# EAGLE design 10AmpBuckV3 (EAGLE 6.4)
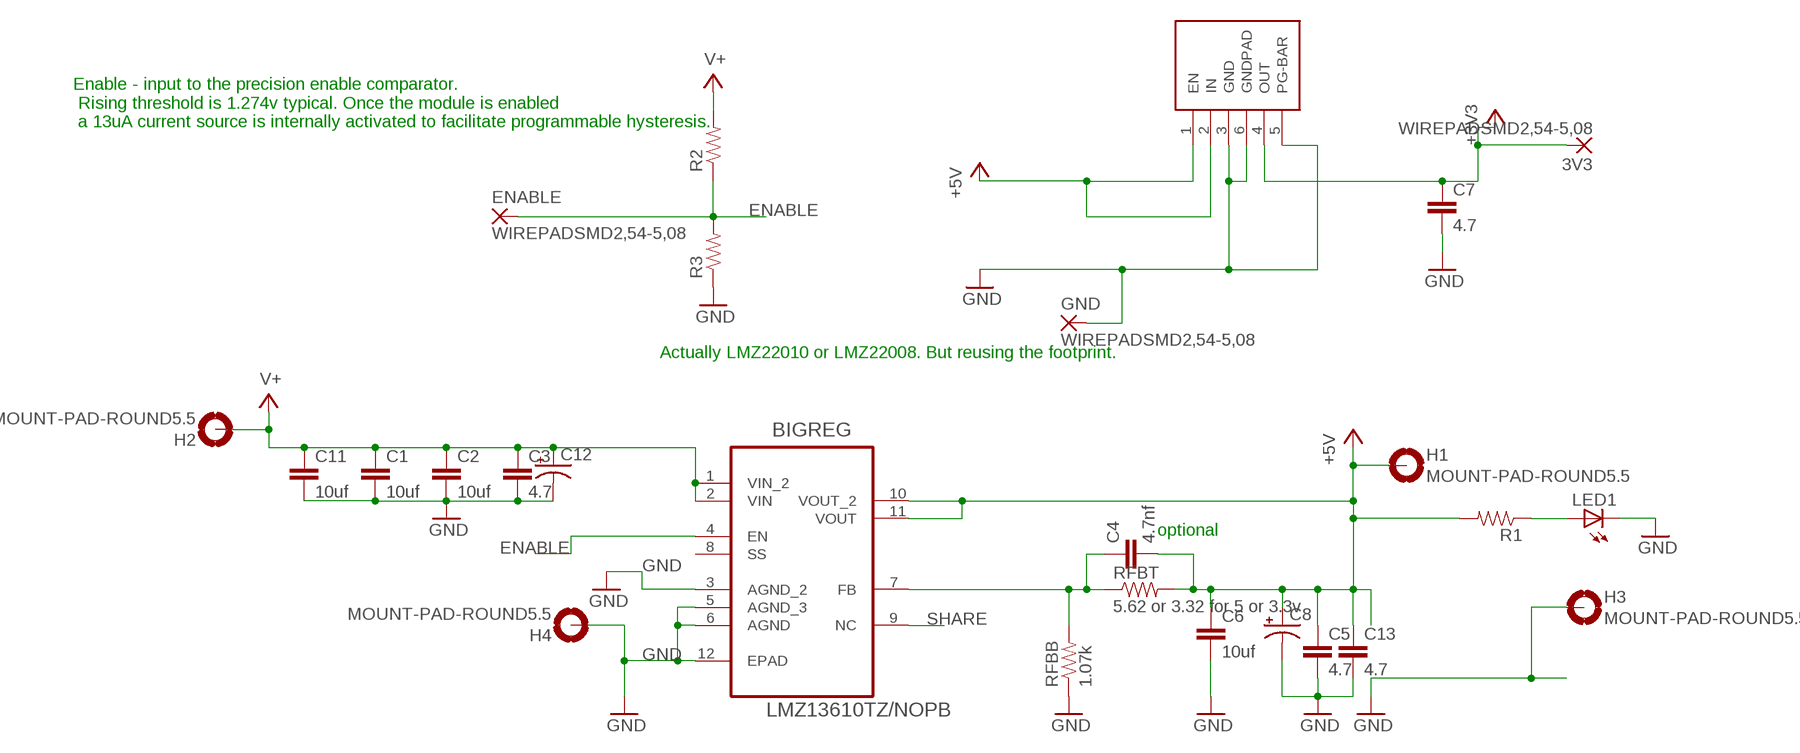
[diagram p0: schematic, sheet 1]

## Parts
3V3  WIREPADSMD2,54-5,08  [SMD2,54-5,08]
BIGREG  LMZ13610TZ/NOPB  [TI_TO-PMOD-11]
C1  10uf  CAP1206  [1206]
C2  10uf  CAP1206  [1206]
C3  4.7  CAP1206  [1206]
C4  4.7nf  CAP0603-CAP  [0603-CAP]
C5  4.7  CAP1206  [1206]
C6  10uf  CAP1206  [1206]
C7  4.7  CAP1206  [1206]
C8  CAP_POLPTH1  [CPOL-RADIAL-100UF-25V]
C11  10uf  CAP1206  [1206]
C12  CAP_POLPTH1  [CPOL-RADIAL-100UF-25V]
C13  4.7  CAP1206  [1206]
ENABLE  WIREPADSMD2,54-5,08  [SMD2,54-5,08]
GND  WIREPADSMD2,54-5,08  [SMD2,54-5,08]
H1  MOUNT-PAD-ROUND5.5  [5,5-PAD]
H2  MOUNT-PAD-ROUND5.5  [5,5-PAD]
H3  MOUNT-PAD-ROUND5.5  [5,5-PAD]
H4  MOUNT-PAD-ROUND5.5  [5,5-PAD]
LED1  LED1206  [LED-1206]
R1  RESISTOR0603-RES  [0603-RES]
R2  RESISTOR0603-RES  [0603-RES]
R3  RESISTOR0603-RES  [0603-RES]
RFBB  1.07k  RESISTOR0603  [0603-RES]
RFBT  5.62 or 3.32 for 5 or 3.3v  RESISTOR0603  [0603-RES]
U$1  TPS75533  [TO263-5]

## Nets
+3V3: 3V3.1(P) C7.1 U$1.4(OUT)
+5V: BIGREG.10(VOUT_2) BIGREG.11(VOUT) C4.2 C5.1 C6.1 C8.1(+) C13.1 H1.B5,5(MOUNT) R1.2 RFBT.2 U$1.1(EN) U$1.2(IN)
ENABLE: BIGREG.4(EN) ENABLE.1(P) R2.1 R3.2
GND: BIGREG.3(AGND_2) BIGREG.5(AGND_3) BIGREG.6(AGND) BIGREG.12(EPAD) C1.2 C2.2 C3.2 C5.2 C6.2 C7.2 C8.2(-) C11.2 C12.2(-) C13.2 GND.1(P) H3.B5,5(MOUNT) H4.B5,5(MOUNT) LED1.C R3.1 RFBB.1 U$1.3(GND) U$1.5(PG-BAR) U$1.6(GNDPAD)
N$2: BIGREG.7(FB) C4.1 RFBB.2 RFBT.1
N$3: LED1.A R1.1
SHARE: BIGREG.9(NC)
V+: BIGREG.1(VIN_2) BIGREG.2(VIN) C1.1 C2.1 C3.1 C11.1 C12.1(+) H2.B5,5(MOUNT) R2.2
Unconnected: BIGREG.8(SS)

## Notes on the sheet
- Enable - input to the precision enable comparator.
   Rising threshold is 1.274v typical. Once the module is enabled
   a 13uA current source is internally activated to facilitate programmable hysteresis.
- Actually LMZ22010 or LMZ22008. But reusing the footprint.
- optional

## Library data of the parts
3V3 ENABLE GND = wirepad:WIREPAD: Wire PAD connect wire on PCB
BIGREG = TI-Eagle_library:LMZ13610TZ/NOPB: BUCK, SYNC, ADJ, 10A, TO-PMOD-11; MPN: LMZ13610TZ/NOPB; OC_FARNELL: 1922943; OC_NEWARK: 47T7393; PACKAGE: TO-PMOD-11; SUPPLIER: TEXAS INSTRUMENTS
C1-C3 C5-C7 C11 C13 = SparkFun-Capacitors:CAP: Capacitor Standard 0603 ceramic capacitor, and 0.1" leaded capacitor.
C4 = SparkFun-Passives:CAP: Capacitor Standard 0603 ceramic capacitor, and 0.1" leaded capacitor.
C8 C12 = SparkFun-Capacitors:CAP_POL: Capacitor Polarized These are standard SMD and PTH capacitors. Normally 10uF, 47uF, and 100uF in electrolytic and tantalum varieties. Always verify the external diameter of the through hole cap, it varies with capacity, voltage, and manufacturer. The EIA devices should be standard.
H1-H4 = holes:MOUNT-PAD-ROUND: MOUNTING PAD, round
LED1 = LilyPad-Wearables:LED: LEDs Standard schematic elements and footprints for 5mm, 3mm, 1206, and 0603 sized LEDs. 5mm - Spark Fun Electronics SKU : Comp-SBL
R1-R3 = SparkFun-Passives:RESISTOR: Resistor Basic schematic elements and footprints for 0603, 1206, and PTH resistors.
RFBB RFBT = SparkFun-Resistors:RESISTOR: Resistor Basic schematic elements and footprints for 0603, 1206, and PTH resistors.
U$1 = James:TPS75533

## Net classes
0 default: width 0.762 mm

## Board
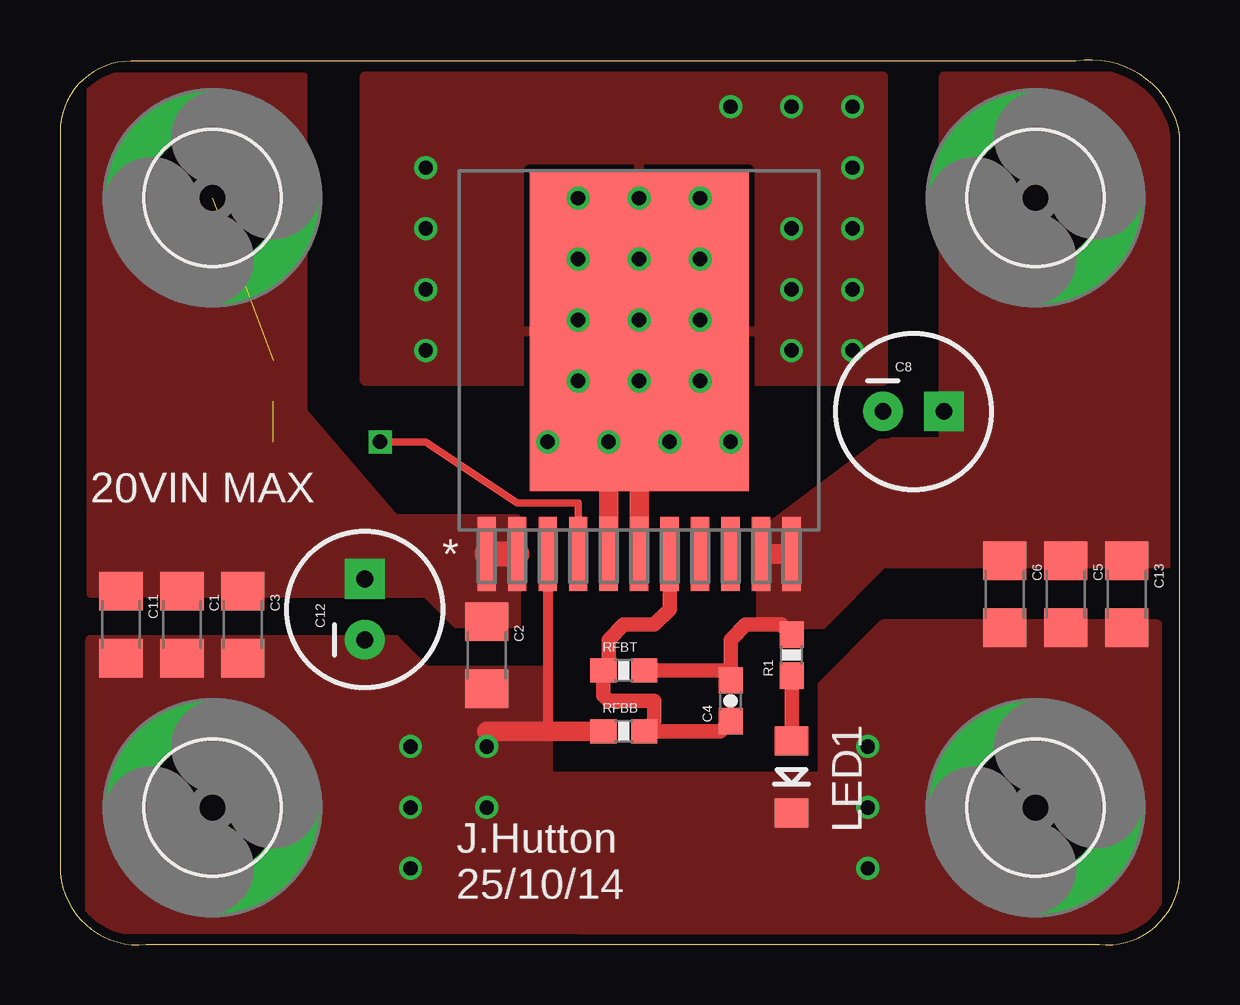
[diagram p1: board, top side]
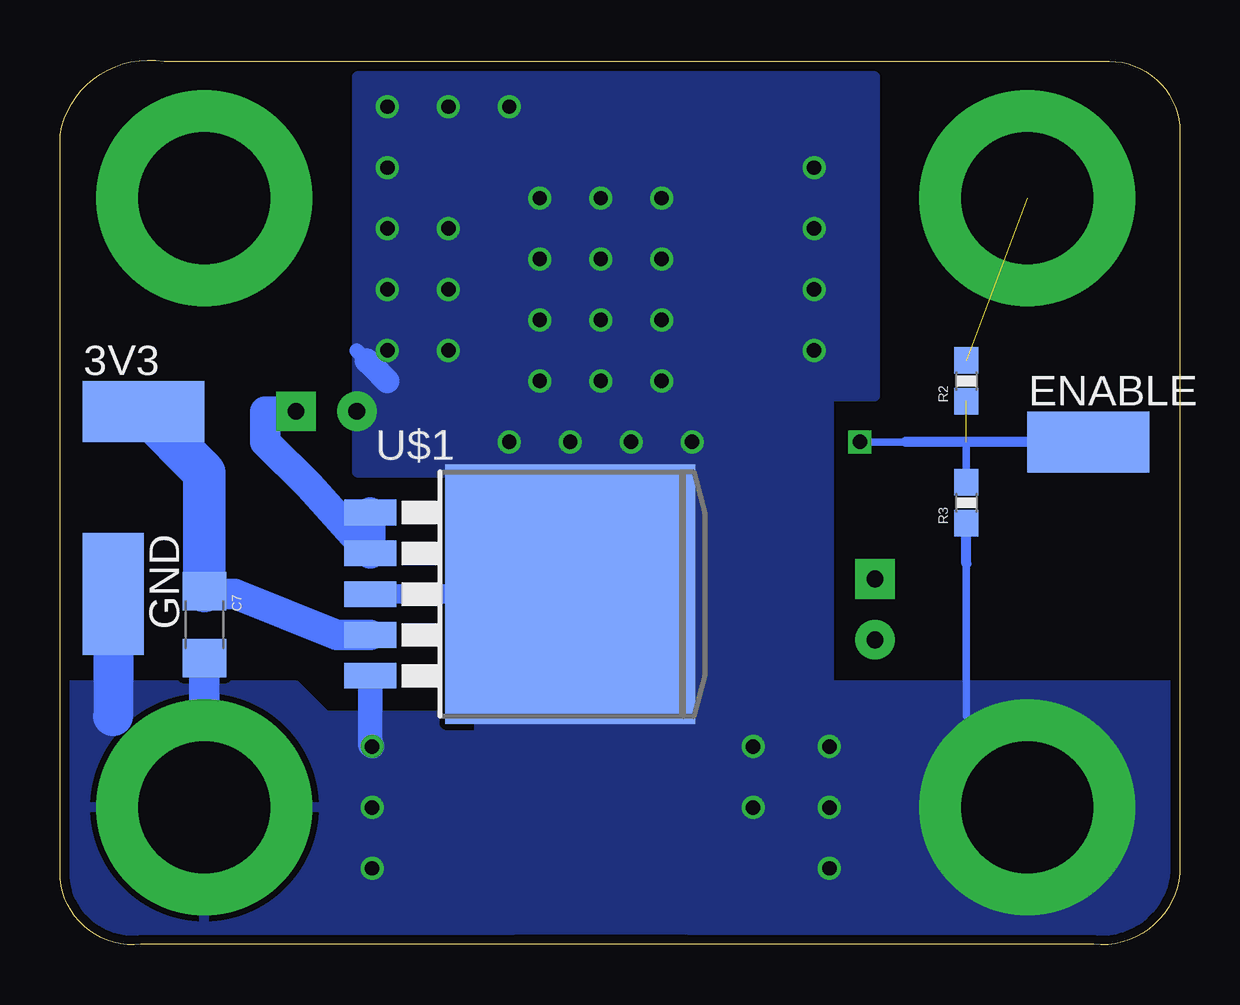
[diagram p2: board, bottom side, seen from below]

Size 46.66 x 36.89 mm. Coordinates in mm from the lower left corner, seen from the top.
Outline: 0,33.89 0,2.97 arc90 3.59,0.02 43.29,0.02 arc90 46.66,2.75 46.66,33.77 arc90 42.32,36.84 2.95,36.84 arc90 0,33.89
Copper layers (1*16): Top 0.0356mm / dielectric 1.5011mm / Bottom 0.0356mm
Design rules "LaenPCBOrder": minimum track width 6mil, minimum drill 13mil, track to track 6mil, track to pad 6mil, pad to pad 6mil, via to via 6mil, smd to smd 6mil, copper to edge 15mil, drill to drill 6mil, minimum pad ring 7mil, minimum via ring 7mil, stop-mask expansion 3mil, vias tented up to drill 0mil, thermal gap 10mil

### Footprints (pad centres in the part's own frame; a part is rotated, then mirrored left to right if it is on the bottom)
SMD2,54-5,08 = smd 2.54 x 5.08: 1 0,0
TI_TO-PMOD-11 = smd 0.762 x 3.099: 1 -6.35,-8.484; 2 -5.08,-8.484; 3 -3.81,-8.484; 4 -2.54,-8.484; 5 -1.27,-8.484; 6 0,-8.484; 7 1.27,-8.484; 8 2.54,-8.484; 9 3.81,-8.484; 10 5.08,-8.484; 11 6.35,-8.484 | smd 9.126 x 13.37: 12 0,0.816
1206 = smd 1.6 x 1.8: 1 -1.4,0; 2 1.4,0
0603-CAP = smd 1.1 x 1: 1 -0.85,0; 2 0.85,0
CPOL-RADIAL-100UF-25V = drill 0.7 pad 1.651 square: 1 1.27,0 | drill 0.7 pad 1.651: 2 -1.27,0
5,5-PAD = drill 5.5 pad 9: B5,5 0,0
LED-1206 = smd 1.2 x 1.4: A -1.5,0; C 1.5,0
0603-RES = smd 1.1 x 1: 1 -0.85,0; 2 0.85,0
TO263-5 = smd 1.067 x 2.159: 1 -3.404,-5.791; 2 -1.702,-5.791; 3 0,-5.791; 4 1.702,-5.791; 5 3.404,-5.791 | smd 10.8 x 10.41: 6 0,2.54

### Placement (x,y rotation side)
3V3  43.18,22.24 270 bottom
BIGREG  24.13,24.78 0 top
C1  5.08,13.35 270 top
C2  17.78,12.08 270 top
C3  7.62,13.35 270 top
C4  27.94,10.18 90 top
C5  41.91,14.62 270 top
C6  39.37,14.62 270 top
C7  40.64,13.35 270 bottom
C8  35.56,22.24 0 top
C11  2.54,13.35 270 top
C12  12.7,13.99 90 top
C13  44.45,14.62 270 top
ENABLE  3.81,20.97 270 bottom
GND  44.45,14.62 180 bottom
H1  40.64,31.13 0 top
H2  6.35,31.13 0 top
H3  40.64,5.73 0 top
H4  6.35,5.73 0 top
LED1  30.48,7 270 top
R1  30.48,12.08 90 top
R2  8.89,23.51 90 bottom
R3  8.89,18.43 90 bottom
RFBB  23.5,8.91 0 top
RFBT  23.5,11.45 0 top
U$1  27.94,14.62 270 bottom

### Tracks (layer width: path | path; a pad name or v marks a point on that pad's centre or on a via)
+3V3
  Bottom 1.016: 40.51,14.62 C7.1
  Bottom 1.27: U$1.4 35.13,12.92 39.37,14.62 40.51,14.62
  Bottom 1.778: 3V3.1 40.64,19.7 C7.1
+5V
  Top 0.61: 27.94,11.45 27.94,12.72 28.57,13.35 30.06,13.35 R1.2 | RFBT.2 27.94,11.45 | 27.94,11.45 C4.2
  Top 0.813: 29.21,17.16 BIGREG.10 BIGREG.11
  Bottom 1.27: U$1.1 U$1.2 36.27,19.14 38.1,20.97 38.1,22.24 C8.1
  pour Top (isolate 0.305, no thermals): 36.83,36.21 46.99,36.21 46.99,15.89 34.29,15.89 31.75,13.35 29.21,13.35 29.21,17.16 34.29,20.97 36.83,20.97
ENABLE  (via drill 0.6)  (1 unrouted)
  Top 0.305: BIGREG.4 21.59,18.43 19.05,18.43 15.24,20.97 v13.34,20.97
  Bottom 0.305: R3.2 8.89,20.97 | 11.43,20.97 v13.34,20.97
  Bottom 0.406: ENABLE.1 8.89,20.97 11.43,20.97
GND  (via drill 0.6)
  Top 0.406: BIGREG.3 20.32,8.91
  Top 0.813: v20.32,20.97 22.86,19.7 | 22.86,19.7 BIGREG.5 | BIGREG.6 24.13,19.7 22.86,19.7 | RFBB.1 20.32,8.91 17.78,8.91
  Bottom 0.305: 8.89,15.89 8.89,9.54
  Bottom 0.406: 8.89,15.89 R3.1
  Bottom 0.61: 34.29,24.78 33.66,24.15
  Bottom 0.813: U$1.3 U$1.6
  Bottom 1.016: 33.87,24.36 33.66,24.15 33.02,23.51 | U$1.5 33.73,8.35 v33.66,8.27
  Bottom 1.27: C7.2 H3.B5,5
  Bottom 1.676: GND.1 44.45,9.54
  other vias: 22.86,20.97 27.94,20.97 25.4,20.97 15.24,24.78 15.24,29.86 15.24,27.32 21.59,28.59 21.59,23.51 21.59,31.13 21.59,26.05 26.67,26.05 26.67,31.13 26.67,23.51 26.67,28.59 33.02,32.4 33.02,29.86 33.02,27.32 24.13,26.05 24.13,31.13 24.13,23.51 24.13,28.59 33.66,3.19 33.66,5.73 14.61,3.19 14.61,8.27 14.61,5.73 15.24,32.4 33.02,34.94 30.48,34.94 27.94,34.94 33.02,24.78 30.48,29.86 30.48,27.32 30.48,24.78 17.78,8.27 17.78,5.73
  pour Bottom (isolate 0.305, no thermals): 14.61,36.21 34.29,36.21 34.29,19.7 29.21,19.7 29.21,4.46 30.48,0.65 14.61,0.65 14.61,22.88 12.7,22.88 12.7,36.21
  pour Top (isolate 0.305, rank 2): 12.7,36.21 34.29,36.21 34.29,23.51 12.7,23.51
  pour Top (isolate 0.305, no thermals): 31.75,10.81 31.75,7 20.32,7 21.59,0.65 45.72,0.65 45.72,13.35 34.29,13.35
  pour Top (isolate 0.305, no thermals): 1.27,5.73 6.35,5.73 7.62,4.46 24.13,4.46 24.13,0.65 1.27,0.65
  pour Top (isolate 0.305, no thermals): 1.27,12.72 13.97,12.72 15.24,11.45 20.32,11.45 20.32,4.46 1.27,4.46
  pour Bottom: 27.94,9.54 35.56,9.54 36.83,10.81 46.99,10.81 46.99,-1.89 27.94,-1.89
  pour Bottom (no thermals): 0,10.81 20.32,10.81 20.32,-0.62 0,-0.62
N$2
  Top 0.61: BIGREG.7 25.4,13.99 24.77,13.35 23.5,13.35 22.86,12.72 22.86,11.66 RFBT.1 22.64,10.39 22.86,10.18 24.77,10.18 24.77,9.33 RFBB.2 27.52,8.91 C4.1
N$3
  Top 0.61: R1.1 LED1.A
V+  (1 unrouted)
  Top 1.016: BIGREG.1 BIGREG.2
  pour Top (isolate 0.305, no thermals): 19.05,13.35 19.05,17.8 13.97,17.8 10.16,22.24 10.16,36.21 1.27,36.21 1.27,14.62 15.24,14.62 16.51,13.35

### Text on the board
tNames: 20VIN MAX | J.Hutton / 25/10/14
bNames: LMZ22010 / RFBB = 1.07K / RFBT = 3.32 for 3V3 / 5.62 for 5V
tValues: LMZ22010 - 20Vin Max